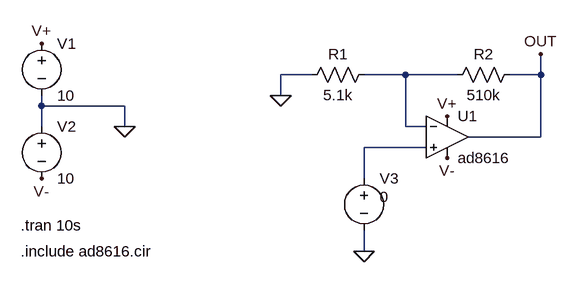
[diagram p0: schematic 006noninverting_amp_ad8616_ac.asc]
006noninverting_amp_ad8616_ac.asc, the LTspice schematic file:
Version 4
SHEET 1 880 680
WIRE 80 96 32 96
WIRE 224 96 160 96
WIRE 304 96 224 96
WIRE 432 96 432 64
WIRE 432 96 384 96
WIRE 32 128 32 96
WIRE -336 144 -336 128
WIRE -208 144 -336 144
WIRE -336 176 -336 144
WIRE -208 176 -208 144
WIRE 224 176 224 96
WIRE 256 176 224 176
WIRE 432 192 432 96
WIRE 432 192 320 192
WIRE 256 208 160 208
WIRE 160 256 160 208
WIRE 160 368 160 336
FLAG -208 176 0
FLAG -336 48 V+
FLAG -336 256 V-
FLAG 288 224 V-
FLAG 288 160 V+
FLAG 432 64 OUT
FLAG 32 128 0
FLAG 160 368 0
SYMBOL voltage -336 32 R0
WINDOW 123 0 0 Left 2
WINDOW 39 0 0 Left 2
SYMATTR InstName V1
SYMATTR Value 10
SYMBOL voltage -336 160 R0
WINDOW 123 0 0 Left 2
WINDOW 39 0 0 Left 2
SYMATTR InstName V2
SYMATTR Value 10
SYMBOL res 176 80 R90
WINDOW 0 0 56 VBottom 2
WINDOW 3 32 56 VTop 2
SYMATTR InstName R1
SYMATTR Value 5.1k
SYMBOL res 400 80 R90
WINDOW 0 0 56 VBottom 2
WINDOW 3 32 56 VTop 2
SYMATTR InstName R2
SYMATTR Value 510k
SYMBOL voltage 160 240 R0
WINDOW 123 24 124 Left 2
WINDOW 39 0 0 Left 2
WINDOW 3 24 44 Left 2
SYMATTR InstName V3
SYMATTR Value 0
SYMBOL Opamps\\opamp2 288 128 R0
SYMATTR InstName U1
SYMATTR Value ad8616
TEXT -368 328 Left 2 !.tran 10s
TEXT -368 368 Left 2 !.include ad8616.cir

The netlist it stands for:
* 006noninverting_amp_ad8616_ac.asc
V1 V+ 0 10
V2 0 V- 10
R1 N001 0 5.1k
R2 OUT N001 510k
V3 N002 0 0
XU1 N002 N001 V+ V- OUT ad8616  ; pins In+ In- V+ V- OUT
.tran 10s
.include ad8616.cir
.backanno
.end